# EAGLE design Э3 (EAGLE 9.6.2)
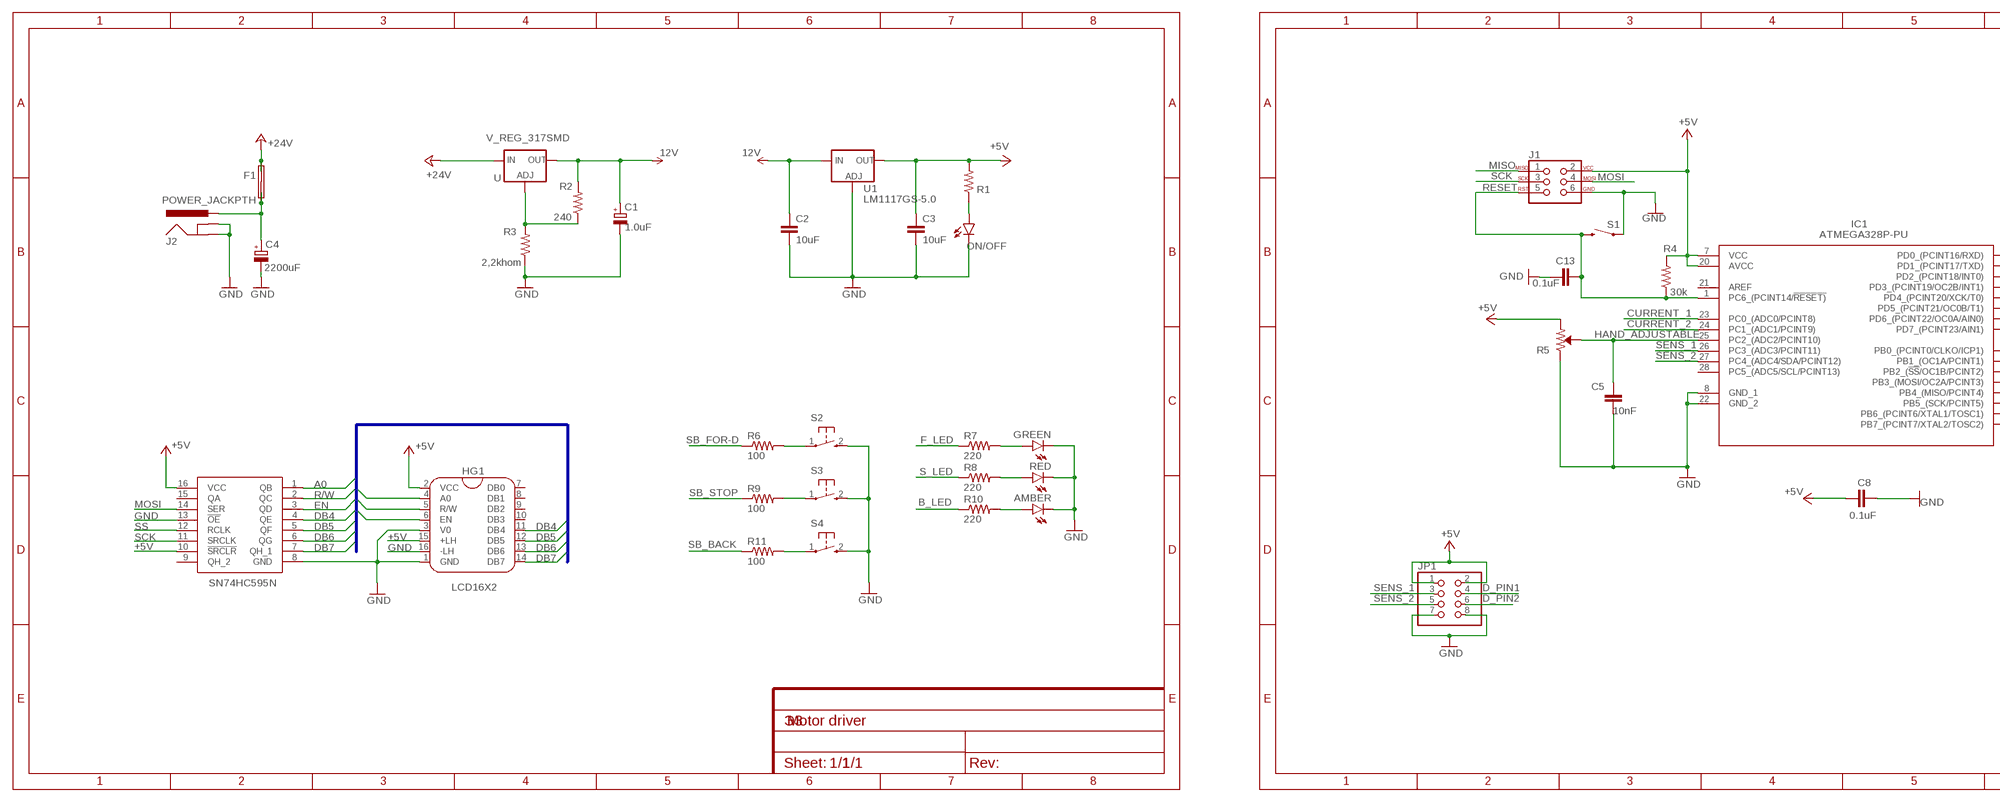
[diagram p0: schematic, sheet 1, part 1 of 2]
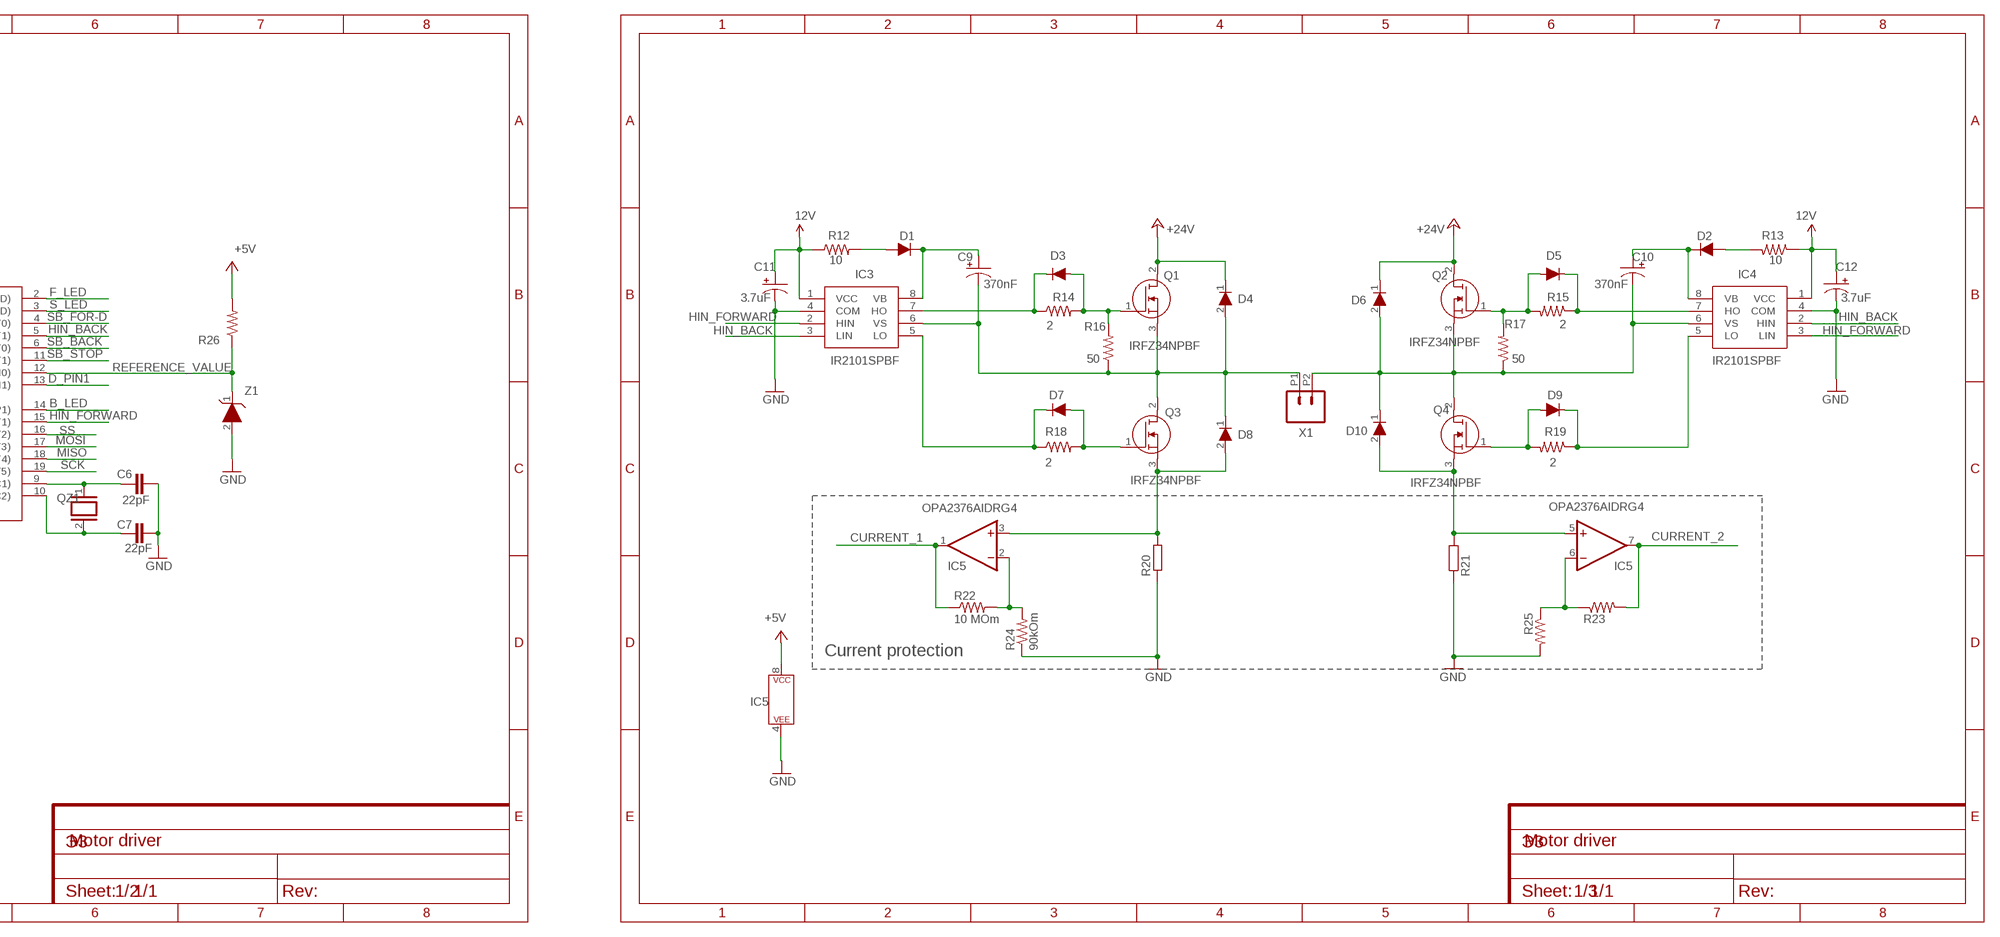
[diagram p1: schematic, sheet 1, part 2 of 2]

## Parts
AMBER  LED-3MM-NO_SILK  [LED3MM-NS]
C1  1.0uF  CPOL-EUE2,5-6E  [E2,5-6E]
C2  10uF  C-EUC1206  [C1206]
C3  10uF  C-EUC1206  [C1206]
C4  2200uF  CPOL-EUE5-10.5  [E5-10,5]
C5  10nF  C-EUC1206  [C1206]
C6  22pF  22PF-PTH-2.54MM-200V-5%  [CAP-PTH-2.54]
C7  22pF  22PF-PTH-2.54MM-200V-5%  [CAP-PTH-2.54]
C8  0.1uF  C-EUC1206  [C1206]
C9  370nF  CPOL-USSMCA  [SMC_A]
C10  370nF  CPOL-USSMCA  [SMC_A]
C11  3.7uF  CPOL-USSMCA  [SMC_A]
C12  3.7uF  CPOL-USSMCA  [SMC_A]
C13  0.1uF  C-EUC1206  [C1206]
D1  MURA110T3G  [DIOM5226X220N]
D2  MURA110T3G  [DIOM5226X220N]
D3  MBR0530T1G  [SOD3716X135N]
D4  1N4007E-E3_73  [DIOAD1405W86L465D235]
D5  MBR0530T1G  [SOD3716X135N]
D6  1N4007E-E3_73  [DIOAD1405W86L465D235]
D7  MBR0530T1G  [SOD3716X135N]
D8  1N4007E-E3_73  [DIOAD1405W86L465D235]
D9  MBR0530T1G  [SOD3716X135N]
D10  1N4007E-E3_73  [DIOAD1405W86L465D235]
F1  SHK20L  [SHK20L]
GREEN  LED-3MM-NO_SILK  [LED3MM-NS]
HG1  LCD16X2  [1X16]
IC1  ATMEGA328P-PU  [DIP794W53P254L3467H457Q28N]
IC2  SN74HC595N  [DIP794W53P254L1930H508Q16N]
IC3  IR2101SPBF  [SOIC127P600X175-8N]
IC4  IR2101SPBF  [SOIC127P600X175-8N]
IC5  OPA2376AIDRG4  [SOIC127P600X175-8N]
J1  AVR_SPI_PROG_3X2PTH  [2X3]
J2  POWER_JACKPTH  [POWER_JACK_PTH]
JP1  PINHD-2X4  [2X04]
ON/OFF  LED-3MM-NO_SILK  [LED3MM-NS]
Q1  IRFZ34NPBF  [TO254P469X1042X1967-3P]
Q2  IRFZ34NPBF  [TO254P469X1042X1967-3P]
Q3  IRFZ34NPBF  [TO254P469X1042X1967-3P]
Q4  IRFZ34NPBF  [TO254P469X1042X1967-3P]
QZ1  XTAL/S  [QS]
R1  200  R-US_R1206  [R1206]
R2  240  R-US_R1206  [R1206]
R3  2,2khom  R-US_R1206  [R1206]
R4  30k  R-US_R1206  [R1206]
R5  TRIMM_POT  [TRIMM_POT]
R6  100  R-US_R1206  [R1206]
R7  220  R-US_R1206  [R1206]
R8  220  R-US_R1206  [R1206]
R9  100  R-US_R1206  [R1206]
R10  220  R-US_R1206  [R1206]
R11  100  R-US_R1206  [R1206]
R12  10  R-US_R1206  [R1206]
R13  10  R-US_R1206  [R1206]
R14  2  R-US_0207/7  [0207/7]
R15  2  R-US_0207/7  [0207/7]
R16  50  R-US_0207/7  [0207/7]
R17  50  R-US_0207/7  [0207/7]
R18  2  R-US_0207/7  [0207/7]
R19  2  R-US_0207/7  [0207/7]
R20  R-EU_R2512  [R2512]
R21  R-EU_R2512  [R2512]
R22  10 MOm  R-US_R1206  [R1206]
R23  R-US_R1206  [R1206]
R24  90kOm  R-US_R1206  [R1206]
R25  R-US_R1206  [R1206]
R26  7  R-US_R1206  [R1206]
RED  LED-3MM-NO_SILK  [LED3MM-NS]
S1  MOMENTARY-SWITCH-SPST-PTH-6.0MM  [TACTILE_SWITCH_PTH_6.0MM]
S2  TAC_SWITCH_SPECIAL  [TACTILE-SPECIAL_PTH]
S3  TAC_SWITCH_SPECIAL  [TACTILE-SPECIAL_PTH]
S4  TAC_SWITCH_SPECIAL  [TACTILE-SPECIAL_PTH]
U  V_REG_317SMD  [SOT223]
U1  LM1117GS-5.0  V_REG_LM1117SOT223  [SOT223]
X1  DG340MY""  [1X02_3.81_SCREWTERM]
Z1  BZV55C3V6-TP"""  [BAQ33GS08]

## Nets
12V: C1.+ C2.1 C11.+ C12.+ IC3.1(VCC) IC4.1(VCC) R2.2 R12.1 R13.1 U1.3(IN) U.2(OUT)
+5V: C3.1 C8.1 HG1.2(VCC) HG1.15(+LH) IC1.7(VCC) IC1.20(AVCC) IC2.10(!SRCLR) IC2.16(VCC) IC5.8(P$V+) J1.2 JP1.1 JP1.2 R1.2 R4.2 R5.1(CCW) R26.2 U1.2(OUT) U1.4(OUT)
+24V: D4.1(K) D6.1(K) F1.2A F1.2B Q1.2(D) Q2.2(D) U.3(IN)
A0: HG1.4(A0) IC2.1(QB)
B_LED: IC1.14(PB0_(PCINT0/CLKO/ICP1)) R10.1
CURRENT_1: IC1.23(PC0_(ADC0/PCINT8)) IC5.1(OUT) R22.1
CURRENT_2: IC1.24(PC1_(ADC1/PCINT9)) IC5.7(OUT) R23.2
D_PIN1: IC1.13(PD7_(PCINT23/AIN1)) JP1.4
D_PIN2: JP1.6
DB4: HG1.11(DB4) IC2.4(QE)
DB5: HG1.12(DB5) IC2.5(QF)
DB6: HG1.13(DB6) IC2.6(QG)
DB7: HG1.14(DB7) IC2.7(QH_1)
EN: HG1.6(EN) IC2.3(QD)
F_LED: IC1.2(PD0_(PCINT16/RXD)) R7.1
GND: AMBER.K(C) C1.- C2.2 C3.2 C4.- C5.2 C6.2 C7.2 C8.2 C11.- C12.- C13.2 GREEN.K(C) HG1.1(GND) HG1.3(V0) HG1.16(-LH) IC1.8(GND_1) IC1.22(GND_2) IC2.8(GND) IC2.13(!OE) IC3.4(COM) IC4.4(COM) IC5.4(P$V-) J1.6 J2.GND J2.GNDBREAK JP1.7 JP1.8 ON/OFF.K(C) R3.1 R5.3(CW) R20.1 R21.1 R24.1 R25.2 RED.K(C) S1.1 S2.2 S3.2 S4.2 U1.1(ADJ) Z1.2(A)
HAND_ADJUSTABLE: C5.1 IC1.25(PC2_(ADC2/PCINT10)) R5.2(WIPER)
HIN_BACK: IC1.5(PD3_(PCINT19/OC2B/INT1)) IC3.3(LIN) IC4.2(HIN)
HIN_FORWARD: IC1.15(PB1_(OC1A/PCINT1)) IC3.2(HIN) IC4.3(LIN)
MISO: IC1.18(PB4_(MISO/PCINT4)) J1.1
MOSI: IC1.17(PB3_(MOSI/OC2A/PCINT3)) IC2.14(SER) J1.4
N$1: ON/OFF.A R1.1
N$2: C4.+ F1.1A F1.1B J2.PWR
N$3: D8.2(A) IC5.3(+IN) Q3.3(S) R20.2
N$4: D10.2(A) IC5.5(+IN) Q4.3(S) R21.2
N$5: GREEN.A R7.2
N$6: R8.2 RED.A
N$8: AMBER.A R10.2
N$9: R2.1 R3.2 U.1(ADJ)
N$10: R6.2 S2.1
N$11: R9.2 S3.1
N$12: R11.2 S4.1
N$13: C6.1 IC1.9(PB6_(PCINT6/XTAL1/TOSC1)) QZ1.1
N$14: C10.+ D2.1(K) IC4.8(VB)
N$15: C7.1 IC1.10(PB7_(PCINT7/XTAL2/TOSC2)) QZ1.2
N$17: C9.+ D1.1(K) IC3.8(VB)
N$18: IC5.2(-IN) R22.2 R24.2
N$19: C9.- D4.2(A) D8.1(K) IC3.6(VS) Q1.3(S) Q3.2(D) R16.1 X1.P1
N$20: IC5.6(-IN) R23.1 R25.1
N$21: D1.2(A) R12.2
N$22: D3.1(K) IC3.7(HO) R14.1
N$24: D3.2(A) Q1.1(G) R14.2 R16.2
N$25: D7.2(A) Q3.1(G) R18.2
N$26: D7.1(K) IC3.5(LO) R18.1
N$27: D2.2(A) R13.2
N$28: C10.- D6.2(A) D10.1(K) IC4.6(VS) Q2.3(S) Q4.2(D) R17.1 X1.P2
N$29: D5.1(K) IC4.7(HO) R15.1
N$32: D5.2(A) Q2.1(G) R15.2 R17.2
N$33: D9.2(A) Q4.1(G) R19.2
N$34: D9.1(K) IC4.5(LO) R19.1
R/W: HG1.5(R/W) IC2.2(QC)
REFERENCE_VALUE: IC1.12(PD6_(PCINT22/OC0A/AIN0)) R26.1 Z1.1(K)
RESET: C13.1 IC1.1(PC6_(PCINT14/!RESET)) J1.5 R4.1 S1.3
S_LED: IC1.3(PD1_(PCINT17/TXD)) R8.1
SB_BACK: IC1.6(PD4_(PCINT20/XCK/T0)) R11.1
SB_FOR-D: IC1.4(PD2_(PCINT18/INT0)) R6.1
SB_STOP: IC1.11(PD5_(PCINT21/OC0B/T1)) R9.1
SCK: IC1.19(PB5_(SCK/PCINT5)) IC2.11(SRCLK) J1.3
SENS_1: IC1.26(PC3_(ADC3/PCINT11)) JP1.3
SENS_2: IC1.27(PC4_(ADC4/SDA/PCINT12)) JP1.5
SS: IC1.16(PB2_(!SS!/OC1B/PCINT2)) IC2.12(RCLK)
Unconnected: HG1.7(DB0) HG1.8(DB1) HG1.9(DB2) HG1.10(DB3) IC1.21(AREF) IC1.28(PC5_(ADC5/SCL/PCINT13)) IC2.9(QH_2) IC2.15(QA)

## Buses
SHIFT:A0,DB[0..7],EN,R/W

## Notes on the sheet
- IC5 | IC5
- Current protection
- IC5
- Motor driver | Motor driver | Motor driver
- 1/1 | 1/2 | 1/3

## Library data of the parts
AMBER GREEN ON/OFF RED = SparkFun-LED:LED: LEDs Standard schematic elements and footprints for 5mm, 3mm, 1206, and 0603 sized LEDs. 5mm - Spark Fun Electronics SKU : COM-00529 (and others)
C1 C4 = rcl:CPOL-EU: POLARIZED CAPACITOR, European symbol; SPICEPREFIX: C
C2 C3 C5 C8 C13 = rcl:C-EU: CAPACITOR, European symbol; SPICEPREFIX: C
C6 C7 = SparkFun-Capacitors:22PF: 22pF ceramic capacitors A capacitor is a passive two-terminal electrical component used to store electrical energy temporarily in an electric field.; PROD_ID: CAP-09128
C9-C12 = rcl:CPOL-US: POLARIZED CAPACITOR, American symbol; SPICEPREFIX: C
D1 D2 = SamacSys_Parts:MURA110T3G: Source: Datasheet <http://www.onsemi.com/pub/Collateral/MURA105T3-D.PDF>; ARROW_PART_NUMBER: MURA110T3G; ARROW_PRICE-STOCK: https://www.arrow.com/en/products/mura110t3g/on-semiconductor; HEIGHT: 2.2mm; MANUFACTURER_NAME: ON Semiconductor; MANUFACTURER_PART_NUMBER: MURA110T3G; MOUSER_PART_NUMBER: 863-MURA110T3G; MOUSER_PRICE-STOCK: https://www.mouser.co.uk/ProductDetail/onsemi/MURA110T3G?qs=Gev%252BmEvV0iY9ayYiEBnOYw%3D%3D
D3 D5 D7 D9 = SamacSys_Parts:MBR0530T1G: Schottky Rectifier 0.5A 30V SOD-123 ON Semiconductor MBR0530T1G Schottky Diode, 0.5A, 30V, 2-Pin SOD-123 Source: Datasheet <http://www.onsemi.com/pub/Collateral/MBR0530T1-D.PDF>; ARROW_PART_NUMBER: MBR0530T1G; ARROW_PRICE-STOCK: https://www.arrow.com/en/products/mbr0530t1g/on-semiconductor?region=nac; DESCRIPTION: Schottky Rectifier 0.5A 30V SOD-123 ON Semiconductor MBR0530T1G Schottky Diode, 0.5A, 30V, 2-Pin SOD-123; HEIGHT: 1.35mm; MANUFACTURER_NAME: ON Semiconductor; MANUFACTURER_PART_NUMBER: MBR0530T1G; MOUSER_PART_NUMBER: 863-MBR0530T1G; MOUSER_PRICE-STOCK: https://www.mouser.co.uk/ProductDetail/onsemi/MBR0530T1G?qs=3JMERSakeboS%2FFOxJUMWeg%3D%3D
D4 D6 D8 D10 = SamacSys_Parts:1N4007E-E3_73: Rectifiers 1.0 Amp 1000 Volt Source: Datasheet <http://www.vishay.com/docs/88503/1n4001.pdf>; ARROW_PART_NUMBER: 1N4007E-E3/73; ARROW_PRICE-STOCK: https://www.arrow.com/en/products/1n4007e-e373/vishay; DESCRIPTION: Rectifiers 1.0 Amp 1000 Volt; HEIGHT: mm; MANUFACTURER_NAME: Vishay; MANUFACTURER_PART_NUMBER: 1N4007E-E3/73; MOUSER_PART_NUMBER: 625-1N4007E-E3/73; MOUSER_PRICE-STOCK: https://www.mouser.co.uk/ProductDetail/Vishay-General-Semiconductor/1N4007E-E3-73?qs=N4vtoAxH%2FSq0sSzLayHxEg%3D%3D
F1 = fuse:SHK20L: FUSE HOLDER 5 x 20 mm, SH contact, SHH1 Schukat, E1073 Buerklin; OC_FARNELL: unknown; OC_NEWARK: unknown
HG1 = My LCD16x2:LCD16X2: LCD 16X2 MT-16S2H2FLA
IC1 = SamacSys_Parts:ATMEGA328P-PU: MICROCHIP - ATMEGA328P-PU. - MICROCONTROLLER MCU, 8 BIT, ATMEGA, 20MHZ, DIP-28 Source: Datasheet <https://datasheet.datasheetarchive.com/originals/distributors/Datasheets_SAMA/59a954cf62ab8fb92f29cdfb51cb433a.pdf>; ARROW_PART_NUMBER: ATMEGA328P-PU; ARROW_PRICE-STOCK: https://www.arrow.com/en/products/atmega328p-pu/microchip-technology?region=nac; DESCRIPTION: MICROCHIP - ATMEGA328P-PU. - MICROCONTROLLER MCU, 8 BIT, ATMEGA, 20MHZ, DIP-28; HEIGHT: 4.572mm; MANUFACTURER_NAME: Microchip; MANUFACTURER_PART_NUMBER: ATMEGA328P-PU; MOUSER_PART_NUMBER: 556-ATMEGA328P-PU; MOUSER_PRICE-STOCK: https://www.mouser.co.uk/ProductDetail/Microchip-Technology-Atmel/ATMEGA328P-PU?qs=K8BHR703ZXguOQv3sKbWcg%3D%3D
IC2 = SamacSys_Parts:SN74HC595N: 8-Bit Shift Registers With 3-State Output Registers Source: Datasheet <http://www.ti.com/lit/ds/symlink/sn74hc595.pdf>; ARROW_PART_NUMBER: SN74HC595N; ARROW_PRICE-STOCK: https://www.arrow.com/en/products/sn74hc595n/texas-instruments; DESCRIPTION: 8-Bit Shift Registers With 3-State Output Registers; HEIGHT: 5.08mm; MANUFACTURER_NAME: Texas Instruments; MANUFACTURER_PART_NUMBER: SN74HC595N; MOUSER_PART_NUMBER: 595-SN74HC595N; MOUSER_PRICE-STOCK: https://www.mouser.co.uk/ProductDetail/Texas-Instruments/SN74HC595N/?qs=IEl3ej0IqwBTHkYa8XPoMQ%3D%3D
IC3 IC4 = SamacSys_Parts:IR2101SPBF: Gate Drivers HI LO SIDE DRVR 600V 130mA 50ns Source: Datasheet <https://www.infineon.com/dgdl/ir2101.pdf?fileId=5546d462533600a4015355c7a755166c>; ARROW_PART_NUMBER: IR2101SPBF; ARROW_PRICE-STOCK: https://www.arrow.com/en/products/ir2101spbf/infineon-technologies-ag?region=nac; DESCRIPTION: Gate Drivers HI LO SIDE DRVR 600V 130mA 50ns; HEIGHT: 1.75mm; MANUFACTURER_NAME: Infineon; MANUFACTURER_PART_NUMBER: IR2101SPBF; MOUSER_PART_NUMBER: 942-IR2101SPBF; MOUSER_PRICE-STOCK: https://www.mouser.co.uk/ProductDetail/Infineon-IR/IR2101SPBF?qs=dQmlx5f5cRK0Gls2VgsKEQ%3D%3D
IC5 = SamacSys_Parts:OPA2376AIDRG4: Precision Amplifiers Prec Lo Noise Lo Quies Current Op Amp Source: Datasheet <https://datasheet.datasheetarchive.com/originals/distributors/SFDatasheet-6/sf-000133686.pdf>; ARROW_PART_NUMBER: OPA2376AIDRG4; ARROW_PRICE-STOCK: https://www.arrow.com/en/products/opa2376aidrg4/texas-instruments; DESCRIPTION: Precision Amplifiers Prec Lo Noise Lo Quies Current Op Amp; HEIGHT: 1.75mm; MANUFACTURER_NAME: Texas Instruments; MANUFACTURER_PART_NUMBER: OPA2376AIDRG4; MOUSER_PART_NUMBER: 595-OPA2376AIDRG4; MOUSER_PRICE-STOCK: https://www.mouser.co.uk/ProductDetail/Texas-Instruments/OPA2376AIDRG4?qs=IUbkBnfnSQIcJ9njy8NzUg%3D%3D
J1 = SparkFun-Connectors:AVR_SPI_PROG_3X2: AVR ISP 6 Pin This is the reduced ISP connector for AVR programming. Common on Arduino. This footprint will take up less PCB space and can be used with a 10-pin to 6-pin adapter such as SKU: BOB-08508 **Special note about "TEST_POINT" package. The stop mask is on the top side, so if you want your programming test points to be on the bottom of your board, make sure to place this package on the bottom side of the board. This also ensure that the orientation to program from the bottom side will be correct. SparkFun Products: SparkFun ISP Pogo Adapter <https://www.sparkfun.com/products/11591> - NS Tiny AVR Programmer <https://www.sparkfun.com/products/11801> -PTH
J2 = SparkFun-Connectors:POWER_JACK: Power Jack This is the standard 5.5mm barrel jack for power. The PTH is the most common, proven, reliable, footprint. The Slot footprint only works if the mill layer is transmitted to the PCB fab house so be warned. Mating wall wart : TOL-00298 (and others); PROD_ID: CONN-08197
JP1 = pinhead:PINHD-2X4: PIN HEADER
Q1-Q4 = IRFZ34NPBF:IRFZ34NPBF: N-channel MOSFET,IRFZ34N 26A 55V Source: Datasheet <https://datasheet.datasheetarchive.com/originals/distributors/Datasheets_SAMA/6217abc42b771e712c1bb559b7791c65.pdf>; ARROW_PART_NUMBER: IRFZ34NPBF; ARROW_PRICE-STOCK: https://www.arrow.com/en/products/irfz34npbf/infineon-technologies-ag?region=nac; DESCRIPTION: N-channel MOSFET,IRFZ34N 26A 55V; HEIGHT: 4.69mm; MANUFACTURER_NAME: Infineon; MANUFACTURER_PART_NUMBER: IRFZ34NPBF; MOUSER_PART_NUMBER: 942-IRFZ34NPBF; MOUSER_PRICE-STOCK: https://www.mouser.co.uk/ProductDetail/Infineon-IR/IRFZ34NPBF?qs=9%252BKlkBgLFf3Kc9ZWbyua6Q%3D%3D
QZ1 = special:XTAL/S: CRYSTAL
R1-R4 R6-R19 R22-R26 = rcl:R-US_: RESISTOR, American symbol; SPICEPREFIX: R
R5 = potentiometers:TRIMM_POT
R20 R21 = rcl:R-EU_: RESISTOR, European symbol; SPICEPREFIX: R
S1 = SparkFun-Switches:MOMENTARY-SWITCH-SPST: Momentary Switch (Pushbutton) - SPST Normally-open (NO) SPST momentary switches (buttons, pushbuttons). Variants PTH-12MM - 12mm square, through-hole Momentary Pushbutton Switch - 12mm Square <https://www.sparkfun.com/products/9190> (COM-09190) PTH-6.0MM, PTH-6.0MM-KIT - 6.0mm square, through-hole Mini Pushbutton Switch <https://www.sparkfun.com/products/97> (COM-00097) KIT package intended for soldering kit's - only one side of pads' copper is exposed. PTH-RIGHT-ANGLE-KIT - Right-angle, through-hole Right Angle Tactile Button <https://www.sparkfun.com/products/10791> - Used on SparkFun BigTime Watch Kit <https://www.sparkfun.com/products/11734> SMD-12MM - 12mm square, surface-mount Tactile Button - SMD (12mm) <https://www.sparkfun.com/products/12993> (COM-12993) Used on SparkFun PicoBoard <https://www.sparkfun.com/products/11888> SMD-4.5MM - 4.5mm Square Trackball Switch Used on SparkFun Blackberry Trackballer Breakout <https://www.sparkfun.com/products/13169> SMD-4.6MMX2.8MM - 4.60mm x 2.80mm, surface mount Used on SparkFun Pro Micro - RP2040 <https://www.sparkfun.com/products/17717> SMD-5.2MM, SMD-5.2-REDUNDANT - 5.2mm square, surface-mount Mini Pushbutton Switch - SMD <https://www.sparkfun.com/products/8720> (COM-08720) Used on Arduino Pro Mini <https://www.sparkfun.com/products/11114> REDUNDANT package connects both switch circuits together SMD-6.0X3.5MM - 6.0 x 3.5mm, surface mount Momentary Reset Switch SMD <https://www.sparkfun.com/products/8229> (COM-08229) SMD-6.2MM-TALL - 6.2mm square, surface mount Tactile Button - SMD (6mm) <https://www.sparkfun.com/products/12992> Used on SparkFun Digital Sandbox <https://www.sparkfun.com/products/12651> SMD-RIGHT-ANGLE - Right-angle, surface mount Used on SparkFun Block for Intel® Edison - Arduino <https://www.sparkfun.com/products/13036>; PROD_ID: SWCH-08441; SF_SKU: COM-00097
S2-S4 = SparkFun-Retired:TAC_SWITCH_SPECIAL: Tac Switch Button commonly used for reset or general input. Spark Fun Electronics SKU : COM-00097 SMT- SWCH-08247
U = SparkFun-PowerIC:V_REG_317: Voltage Regulator Standard LM317 adjustable voltage regulator. AOI (Adjust Output Input). Google 'LM317 Calculator' for easy to use app to get the two resistor values needed. 240/720 for 5V output. 240/390 for 3.3V output. Spark Fun Electronics SKU : COM-00527
U1 = SparkFun-IC-Power:V_REG_LM1117: Voltage Regulator LM1117 Standard adjustable voltage regulator but in SMD form. Spark Fun Electronics SKU : COM-00595; PROD_ID: VREG-08170
X1 = DG340MY:DG340MY: DG340 Функциональное назначение: клеммник винтовой. Шаг контактов: 3.81. Рабочий ток: 7А.
Z1 = SamacSys_Parts:BZV55C3V6-TP: Zener Diodes 3.6V 600Ohms Source: Datasheet <http://www.mccsemi.com/up_pdf/BZV55C Series(MiniMELF).pdf>

## Module ARDUINO_MICRO
Ports: 

### Library data of the parts

## Module DSS
Ports: 

### Library data of the parts

## Board
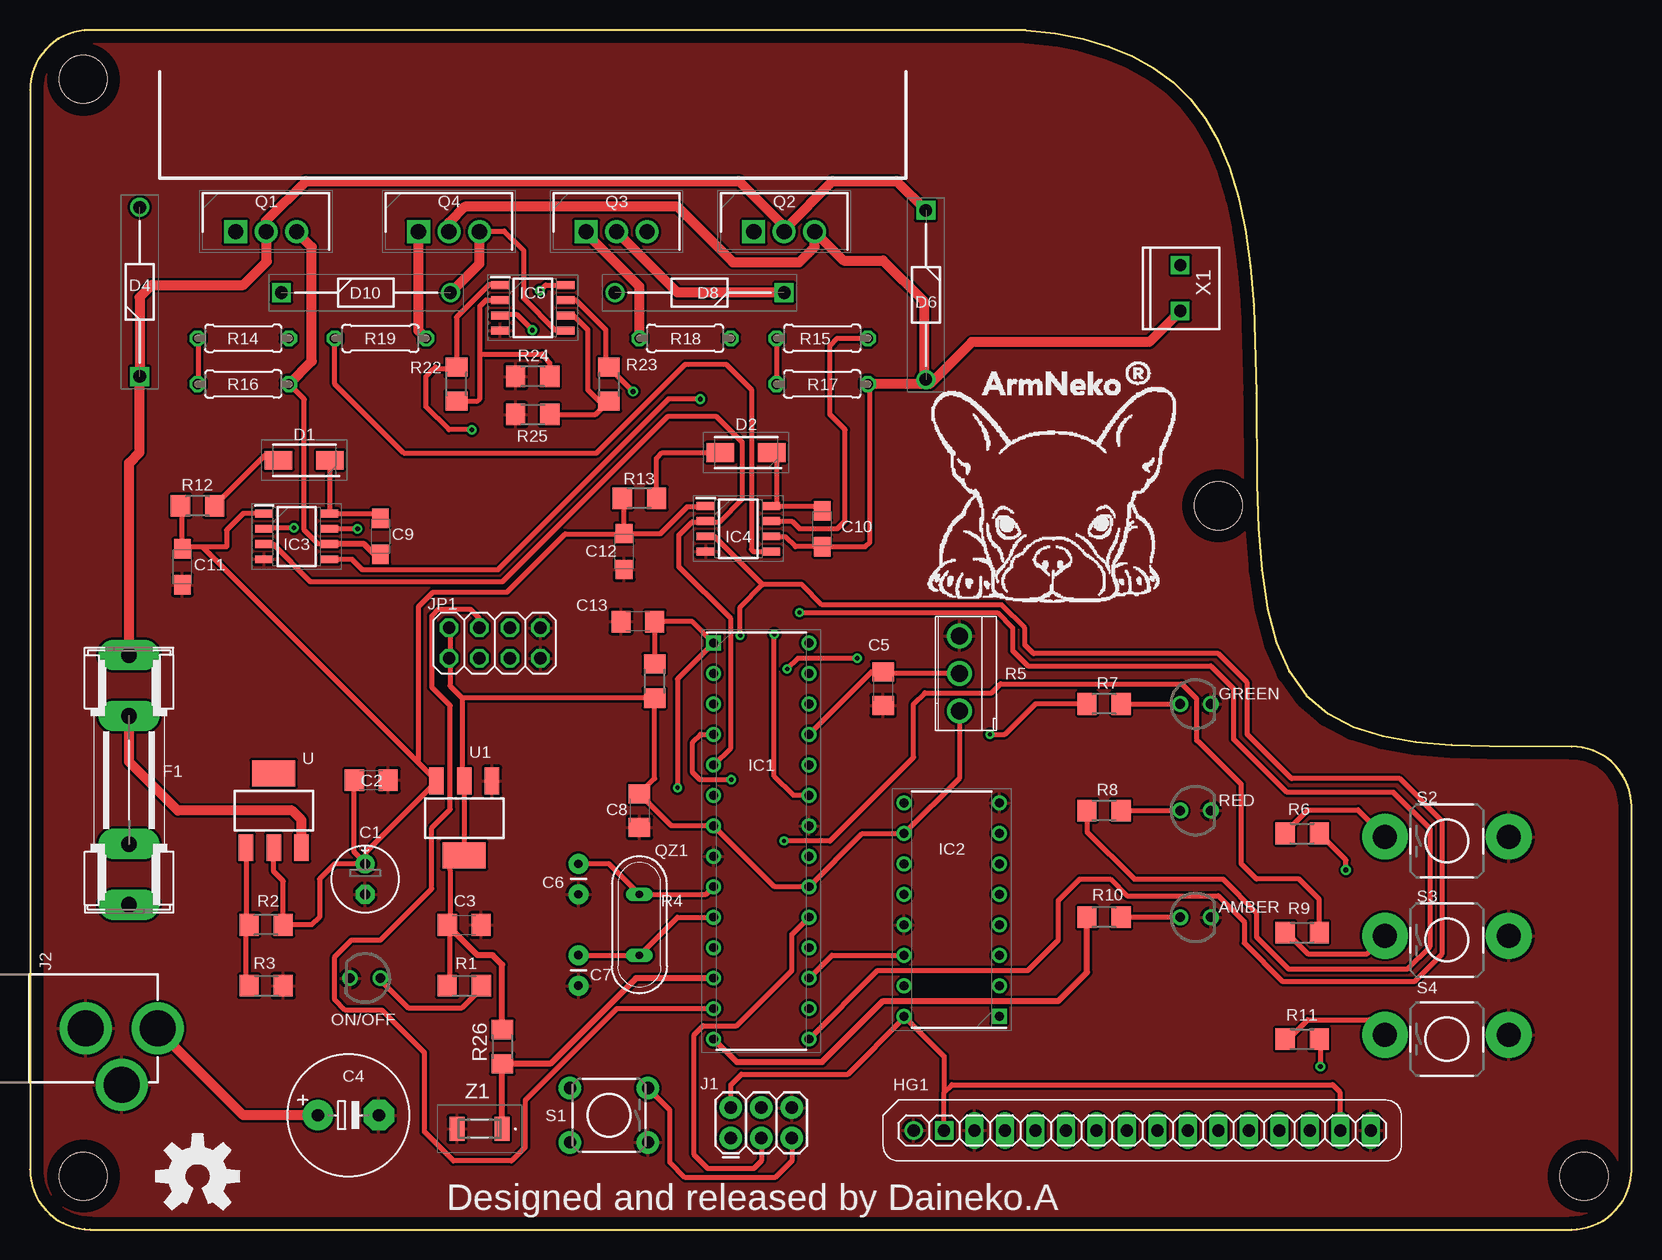
[diagram p2: board, top side]
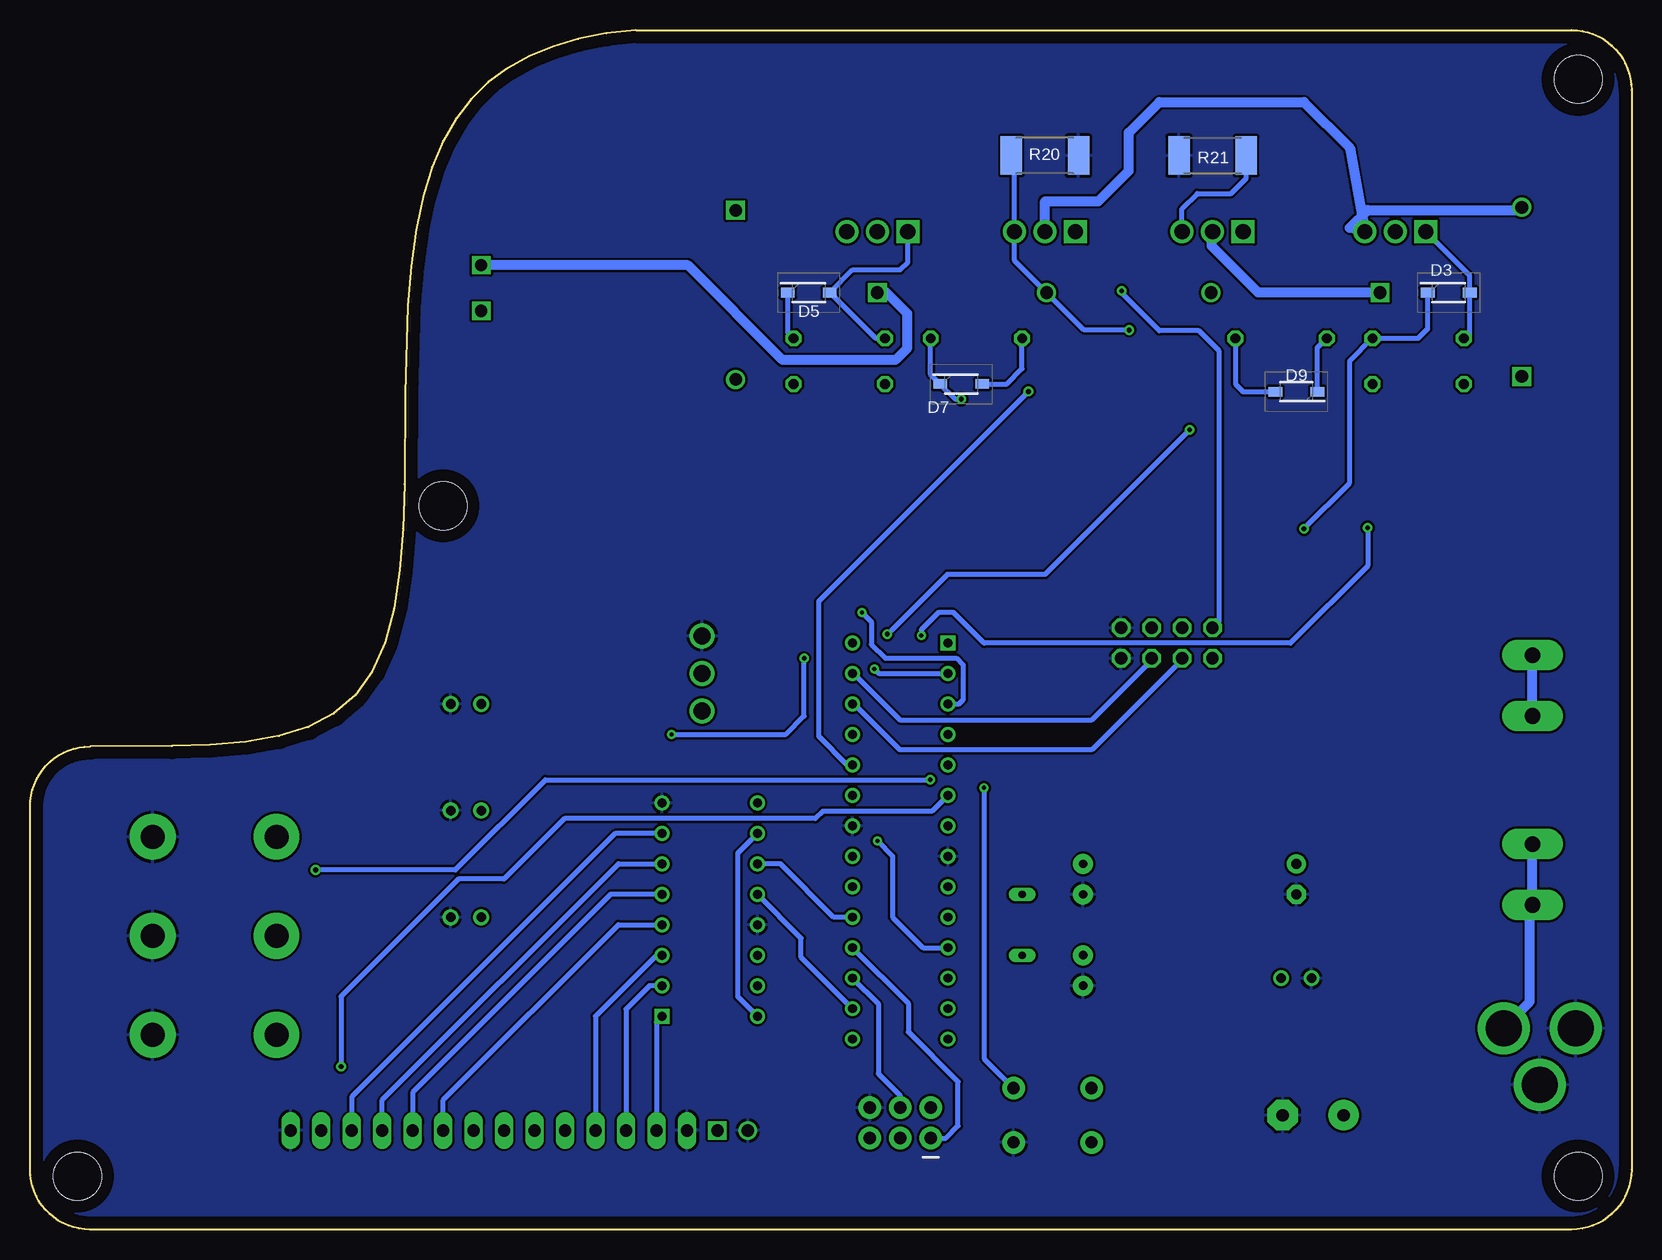
[diagram p3: board, bottom side, seen from below]

Size 133.5 x 100 mm. Coordinates in mm from the lower left corner, seen from the top.
Outline: 83,100 5,100 arc90 0,95 0,5 arc90 5,0 128.5,0 arc90 133.5,5 133.5,35.27 arc90 128.49,40.27 121.67,40.3 118.49,40.41 115.5,40.66 112.76,41.13 110.31,41.89 108.18,43.01 106.4,44.54 104.98,46.51 103.91,48.94 103.16,51.77 102.68,54.97 102.41,58.45 102.29,62.13 102.23,69.72 102,76.99 101.72,80.31 101.3,83.37 100.73,86.12 99.99,88.57 99.08,90.73 98,92.61 96.73,94.24 95.29,95.64 93.68,96.82 91.89,97.81 89.92,98.62 87.78,99.25 85.48,99.71 83,100
Copper layers (1*16): Top 0.035mm / dielectric 1.5mm / Bottom 0.035mm
Design rules "default *": minimum track width 8mil, minimum drill 0.35mm, track to track 8mil, track to pad 8mil, pad to pad 8mil, via to via 8mil, smd to smd 8mil, copper to edge 40mil, drill to drill 6mil, minimum pad ring 10mil, minimum via ring 8mil, stop-mask expansion 4mil, vias tented up to drill 0mil, thermal gap 10mil
Holes 4 mm at 4.45,95.89 99.06,60.33 129.54,4.45 4.45,4.45

### Footprints (pad centres in the part's own frame; a part is rotated, then mirrored left to right if it is on the bottom)
LED3MM-NS = drill 0.813: A -1.27,0; K 1.27,0
E2,5-6E = drill 0.813 pad 1.575: + -1.27,0 | drill 0.813 pad 1.575 octagon: - 1.27,0
C1206 = smd 1.6 x 1.8: 1 -1.4,0; 2 1.4,0
E5-10,5 = drill 1.016 pad 2.54: + -2.54,0 | drill 1.016 pad 2.54 octagon: - 2.54,0
CAP-PTH-2.54 = drill 0.7 pad 1.651: 1 -1.27,0; 2 1.27,0
SMC_A = smd 1.6 x 1.4: + -1.5,0; - 1.5,0
DIOM5226X220N = smd 2.3 x 1.55: 1 -2.15,0; 2 2.15,0
SOD3716X135N = smd 1.15 x 0.8: 1 -1.75,0; 2 1.75,0
DIOAD1405W86L465D235 = drill 1.05 pad 1.575 square: 1 0,0 | drill 1.05 pad 1.575: 2 14.1,0
SHK20L = drill 1.321 pad 2.54 long: 1A -10.414,0; 1B -5.334,0; 2A 10.414,0; 2B 5.334,0
1X16 = drill 1.016: 1 2.54,-2.54 | drill 1.016 square: 2 5.08,-2.54 | drill 1.016 long: 3 7.62,-2.54; 4 10.16,-2.54; 5 12.7,-2.54; 6 15.24,-2.54; 7 17.78,-2.54; 8 20.32,-2.54; 9 22.86,-2.54; 10 25.4,-2.54; 11 27.94,-2.54; 12 30.48,-2.54; 13 33.02,-2.54; 14 35.56,-2.54; 15 38.1,-2.54; 16 40.64,-2.54
DIP794W53P254L3467H457Q28N = drill 0.733 pad 1.133 square: 1 -3.969,16.51 | drill 0.733 pad 1.133: 2 -3.969,13.97; 3 -3.969,11.43; 4 -3.969,8.89; 5 -3.969,6.35; 6 -3.969,3.81; 7 -3.969,1.27; 8 -3.969,-1.27; 9 -3.969,-3.81; 10 -3.969,-6.35; 11 -3.969,-8.89; 12 -3.969,-11.43; 13 -3.969,-13.97; 14 -3.969,-16.51; 15 3.969,-16.51; 16 3.969,-13.97; 17 3.969,-11.43; 18 3.969,-8.89; 19 3.969,-6.35; 20 3.969,-3.81; 21 3.969,-1.27; 22 3.969,1.27; 23 3.969,3.81; 24 3.969,6.35; 25 3.969,8.89; 26 3.969,11.43; 27 3.969,13.97; 28 3.969,16.51
DIP794W53P254L1930H508Q16N = drill 0.73 pad 1.13 square: 1 -3.97,8.89 | drill 0.73 pad 1.13: 2 -3.97,6.35; 3 -3.97,3.81; 4 -3.97,1.27; 5 -3.97,-1.27; 6 -3.97,-3.81; 7 -3.97,-6.35; 8 -3.97,-8.89; 9 3.97,-8.89; 10 3.97,-6.35; 11 3.97,-3.81; 12 3.97,-1.27; 13 3.97,1.27; 14 3.97,3.81; 15 3.97,6.35; 16 3.97,8.89
SOIC127P600X175-8N = smd 1.528 x 0.65: 1 -2.711,1.905; 2 -2.711,0.635; 3 -2.711,-0.635; 4 -2.711,-1.905; 5 2.711,-1.905; 6 2.711,-0.635; 7 2.711,0.635; 8 2.711,1.905
2X3 = drill 1.016 pad 1.88: 1 0,0; 2 0,2.54; 3 2.54,0; 4 2.54,2.54; 5 5.08,0; 6 5.08,2.54
POWER_JACK_PTH = drill 2.997 pad 4.318: GND 0,7.7; GNDBREAK 4.7,10.7; PWR 0,13.7
2X04 = drill 1.016 octagon: 1 -3.81,-1.27; 2 -3.81,1.27; 3 -1.27,-1.27; 4 -1.27,1.27; 5 1.27,-1.27; 6 1.27,1.27; 7 3.81,-1.27; 8 3.81,1.27
TO254P469X1042X1967-3P = drill 1.28 pad 1.92 square: 1 0,0 | drill 1.28 pad 1.92: 2 2.54,0; 3 5.08,0
QS = drill 0.61 long: 1 -2.54,0; 2 2.54,0
R1206 = smd 1.6 x 1.803: 1 -1.422,0; 2 1.422,0
TRIMM_POT = drill 1.4: 1 -3.135,2.54; 2 0,2.54; 3 3.135,2.54
0207/7 = drill 0.813 octagon: 1 -3.81,0; 2 3.81,0
R2512 = smd 1.8 x 3.2: 1 -2.8,0; 2 2.8,0
TACTILE_SWITCH_PTH_6.0MM = drill 1.016 pad 1.88: 1 -3.251,2.261; 2 3.251,2.261; 3 -3.251,-2.261; 4 3.251,-2.261
TACTILE-SPECIAL_PTH = drill 2 pad 3.81: 1 -5.156,0.356; 2 5.156,0.356
SOT223 = smd 1.219 x 2.235: 1 -2.311,-3.099; 2 0,-3.099; 3 2.311,-3.099 | smd 3.6 x 2.2: 4 0,3.099
1X02_3.81_SCREWTERM = drill 1.016 square: P1 3.175,0; P2 -0.635,0
BAQ33GS08 = smd 1.25 x 2: 1 -1.875,0; 2 1.875,0

### Placement (x,y rotation side)
AMBER  97.16,26.04 0 top
C1  27.94,29.21 270 top
C2  28.45,37.47 0 top
C3  36.2,25.4 0 top
C4  26.54,9.53 0 top
C5  71.12,45.09 270 top
C6  45.72,29.21 270 top
C7  45.72,21.59 270 top
C8  50.8,34.92 270 top
C9  29.21,57.78 270 top
C10  66.04,58.42 270 top
C11  12.7,55.24 270 top
C12  49.53,56.52 270 top
C13  50.67,50.67 180 top
D1  22.86,64.14 180 top
D2  59.69,64.77 180 top
D3  15.24,78.11 0 bottom
D4  9.14,71.12 90 top
D5  68.58,78.11 0 bottom
D6  74.68,84.96 270 top
D7  55.88,70.48 0 bottom
D8  62.87,78.11 180 top
D9  27.94,69.85 180 bottom
D10  20.95,78.11 0 top
F1  8.26,37.47 90 top
GREEN  97.16,43.81 0 top
HG1  71.12,10.79 0 top
IC1  60.96,32.38 0 top
IC2  76.83,26.67 180 top
IC3  22.23,57.78 0 top
IC4  59.05,58.42 0 top
IC5  41.91,76.83 0 top
J1  58.42,7.62 0 top
J2  -3.05,16.76 270 top
JP1  38.73,48.9 0 top
ON/OFF  27.94,20.95 180 top
Q1  17.14,83.19 0 top
Q2  60.33,83.19 0 top
Q3  46.35,83.19 0 top
Q4  32.38,83.19 0 top
QZ1  50.8,25.4 270 top
R1  36.2,20.32 180 top
R2  19.68,25.4 0 top
R3  19.68,20.32 180 top
R4  52.07,45.72 270 top
R5  80.01,46.35 90 top
R6  106.05,33.02 180 top
R7  89.53,43.81 0 top
R8  89.53,34.92 0 top
R9  106.05,24.77 180 top
R10  89.53,26.04 0 top
R11  106.05,15.88 180 top
R12  13.97,60.33 0 top
R13  50.8,60.96 0 top
R14  17.78,74.3 180 top
R15  66.04,74.3 180 top
R16  17.78,70.48 180 top
R17  66.04,70.48 180 top
R18  54.61,74.3 180 top
R19  29.21,74.3 0 top
R20  48.9,89.53 180 bottom
R21  34.92,89.53 0 bottom
R22  35.56,70.48 270 top
R23  48.26,70.48 90 top
R24  41.91,71.12 0 top
R25  41.91,67.94 180 top
R26  39.37,15.24 90 top
RED  97.16,34.92 0 top
S1  48.26,9.53 180 top
S2  118.11,32.38 0 top
S3  118.11,24.13 0 top
S4  118.11,15.88 0 top
U  20.32,34.92 0 top
U1  36.2,34.29 180 top
U$1  [OSHW-LOGO-L]  13.97,4.45 0 top
X1  95.89,77.22 90 top
Z1  37.47,8.38 180 top

### Tracks (layer width: path | path; a pad name or v marks a point on that pad's centre or on a via)
12V
  Top 0.203: 12.88,56.9 C11.+ | 12.65,60.25 R12.1 | 28,30.5 C1.+ | 49.5,58 C12.+
  Top 0.406: IC4.1 56.27,60.25 54.76,60.25 52.51,57.99 49.55,57.99 C12.+ 49.5,58.5 49.5,60.5 R13.1 | C2.1 27,37 27,31.5 28,30.5 28,31.5 33.5,37 U1.3 | 49.5,58 44.62,58 39.76,53.14 33.6,53.14 32.38,51.92 32.38,38.89 U1.3 | C11.+ 12.7,60.2 12.65,60.25 | U1.3 14.38,56.9 | 14.38,56.9 12.88,56.9 | IC3.1 17.78,59.69 16.38,58.29 16.38,56.9 14.38,56.9 | C1.+ 25.4,30.48 24.13,29.21 24.13,26.04 23.5,25.4 R2.2 21.11,29.06 20.32,29.84 U.2
+5V  (via drill 0.4)
  Top 0.203: 35,25 34.82,25.35 C3.1 35,25.5 | 35,20.5 R1.2 | 36.25,37.32 U1.2 36,37.5 | 36.25,31.24 U1.4 36,31 35,30
  Top 0.406: 35,20.5 35,25 | 36.25,31.24 36.25,37.32 | 35,30 35,25.5 | 35,48 35,50 JP1.2 | 35,48 35,45.32 36,44.32 | 36,44.32 36,37.5 | 35,48 JP1.1 | v42.49,78.25 42.99,78.74 IC5.8 | R5.1 77.47,37.62 IC2.10 69.37,33.02 IC1.20 62.07,28.57 IC1.7 53.47,33.66 C8.1 52.07,37.59 R4.2 36.02,44.3 36,44.32 | J1.2 58.42,12.06 59.31,12.95 68.18,12.95 72.86,17.64 IC2.16 76.2,14.45 76.2,11.43 | HG1.2 76.2,11.43 | 76.2,11.43 76.83,12.06 108.58,12.06 109.22,11.43 HG1.15
  Top 0.508: R26.2 39.37,22.07 38.58,22.86 37.31,22.86 34.82,25.35
  Bottom 0.406: JP1.2 34.37,50.73 34.37,73.23 36.07,74.93 39.37,74.93 42.49,78.05 v42.49,78.25 | IC2.10 74.5,31.39 74.5,19.41 IC2.16
+24V
  Top 0.813: D6.1 72.23,87.41 66.91,87.41 63,83.5 Q2.2 62.87,83.64 59.09,87.41 23.01,87.41 19.68,84.09 Q1.2 19.73,83.18 19.73,80.69 17.78,78.74 10.16,78.74 9.14,77.72 D4.1 9.14,64.79 8.26,63.91 F1.2A | U.3 22.63,34.14 21.84,34.92 12.32,34.92 8.26,38.99 F1.2B
  Bottom 0.813: F1.2B F1.2A
A0
  Bottom 0.406: IC2.1 81.28,17.3 HG1.4
B_LED
  Top 0.508: IC1.14 58.9,13.97 66.04,13.97 71.12,19.05 85.72,19.05 88.11,21.44 R10.1
CURRENT_1  (via drill 0.4)
  Top 0.406: IC5.1 39.19,78.75 38.25,78.75 35.56,76.06 R22.1 35.41,71.75 33.66,71.75 | IC1.23 63.63,36.2 62.04,37.78 v62.04,49.63 | v36.83,66.67 34.92,66.67 33.02,68.58 33.02,71.12 33.66,71.75 | 33.81,71.91 33.66,71.75
  Bottom 0.406: v36.83,66.67 48.9,54.61 57.02,54.61 62,49.63 v62.04,49.63
CURRENT_2  (via drill 0.4)
  Top 0.203: 48,72 R23.2
  Top 0.406: IC5.7 44.59,77.5 45.5,77.5 48,75 48,72 | R23.2 48.37,71.8 48.37,71.77 v50.27,69.86
  Bottom 0.406: IC1.24 65.38,38.73 67.77,41.13 67.77,52.37 v50.27,69.86
D_PIN1
  Top 0.406: IC1.13 48.91,18.41 41.27,10.78 41.27,6.86 40.13,5.71 35.31,5.71 32.89,8.13 32.89,14.73 29.34,18.29 26.29,18.29 25.4,19.18 25.4,22.73 26.8,24.13 29.21,24.13 33.48,28.4 33.48,33.48 35.03,35.02 35.03,43.67 33.5,45.2 33.5,51.16 34.06,51.71 36.68,51.71 37.47,50.93 JP1.4
DB4
  Bottom 0.406: HG1.11 99.06,10.79 84.45,25.4 IC2.4
DB5
  Bottom 0.406: IC2.5 85.09,27.94 101.6,11.43 HG1.12
DB6
  Bottom 0.406: HG1.13 104.14,10.79 84.45,30.48 IC2.6
DB7
  Bottom 0.406: IC2.7 84.71,33.02 106.68,11.05 HG1.14
EN
  Bottom 0.406: IC2.3 81.28,22.86 86.36,17.78 HG1.6
F_LED  (via drill 0.35)
  Top 0.406: R7.1 83.82,43.81 81.28,41.27 v80.01,41.27 | v68.96,47.62 64.01,47.62 v63.12,46.74
  Bottom 0.406: v80.01,41.27 70.48,41.27 68.96,42.8 v68.96,47.62 | v63.12,46.74 62.74,46.35 IC1.2
GND
  pour Bottom: 133.1,-0.25 1.52,-0.25 0,1.27 0,97.79 2.54,100.33 91.44,100.33 104.14,87.63 104.14,49.53 111.76,41.91 130.81,41.91 133.99,38.73 133.99,0.64
  pour Top: 133.1,-0.25 1.52,-0.25 0,1.27 0,97.79 2.54,100.33 91.44,100.33 104.14,87.63 104.14,49.53 111.76,41.91 130.81,41.91 133.99,38.73 133.99,0.64
HAND_ADJUSTABLE
  Top 0.406: IC1.25 70.14,46.48 C5.1 71.25,46.35 R5.2
HIN_BACK
  Top 0.203: 19.59,57.13 IC3.3
  Top 0.406: 19.59,57.13 20.25,57.13 23.39,53.99 39.36,53.99 53.13,67.77 57.23,67.77 59.38,65.62 59.38,60.88 57.5,59 56.5,59 | 56.5,59 IC4.2 | IC1.5 58.42,40.16 58.42,50.93 54.1,55.24 54.1,57.91 55.19,59 56.5,59
HIN_FORWARD  (via drill 0.35, 0.4)
  Top 0.406: v22,58.5 20,58.5 IC3.2 | IC1.15 70.64,21.59 83.19,21.59 85.72,24.13 85.72,27.43 87.5,29.21 90.04,29.21 91.44,27.81 99.06,27.81 101.22,25.65 101.22,23.88 104.39,20.7 115.44,20.7 117.73,22.99 117.73,34.04 114.17,37.59 105.16,37.59 101.47,41.27 101.47,45.59 99.06,48.01 83.67,48.01 82.93,48.74 82.93,50.14 81,52.07 66.04,52.07 64.36,53.75 61.08,53.75 | IC4.3 57.05,57.78 61.08,53.75 | v59.2,49.53 59.2,51.87 61.08,53.75
  Bottom 0.406: v22,58.5 22,55.33 28.43,48.9 53.98,48.9 56.52,51.44 57.78,51.44 59.2,50.02 v59.2,49.53
MISO
  Bottom 0.406: J1.1 57.15,7.62 56.13,8.64 56.13,12.32 60.28,16.46 60.28,18.84 IC1.18
MOSI
  Top 0.406: IC1.17 66.83,22.86 IC2.14
  Bottom 0.406: J1.4 60.96,11.18 62.78,13 62.78,18.81 IC1.17
N$1
  Top 0.406: R1.1 37.5,20 36,18.5 31.5,18.5 29.5,20.5 ON/OFF.A
N$2
  Top 0.813: C4.+ 17.78,9.53 10.65,16.65 J2.PWR
  Bottom 0.203: 10.5,17 J2.PWR
  Bottom 0.813: 10.5,17 8.5,19 8.5,27 F1.1A F1.1B
N$3  (via drill 0.4)
  Top 0.406: v41.88,74.98 40.61,76.25 39.25,76.25 IC5.3
  Bottom 0.406: v41.88,74.98 45.64,74.98 D8.2 51.44,80.78 Q3.3 51.44,89.28 R20.2
N$4
  Top 0.406: IC5.5 44.5,75 43.75,75 41.13,77.63 41.13,81.65 39.53,83.25 37.53,83.25 Q4.3
  Top 0.813: D10.2 37.47,80.52 Q4.3
  Bottom 0.406: Q4.3 37.47,85.09 36.2,86.36 33.4,86.36 32.12,87.63 R21.2
N$5
  Top 0.406: R7.2 GREEN.A
N$6
  Top 0.406: R8.2 RED.A
N$8
  Top 0.406: AMBER.A R10.2
N$9
  Top 0.203: 18,25.5 R2.1
  Top 0.406: R2.1 18.01,25.65 U.1 | R3.2 18,20.58 18,25.5
N$10
  Top 0.203: 105,33.5 R6.2
  Top 0.406: 105,33.5 106.5,35 110.69,35 S2.1
N$11
  Top 0.406: R9.2 105,24.5 106.5,23 111.47,23 S3.1
N$12
  Top 0.203: 105,16 R11.2
  Top 0.406: 105,16 106.5,17.5 111.68,17.5 S4.1
N$13
  Top 0.406: IC1.9 56.36,27.94 QZ1.1 48.26,30.48 C6.1
N$14
  Top 0.406: IC4.8 62.23,60.33 | 62.23,60.33 65.64,60.33 C10.+ | 62.23,60.33 62.23,64.38 D2.1
N$15
  Top 0.406: IC1.10 53.98,26.04 QZ1.2 C7.1
N$17
  Top 0.406: 25,64 25,60 IC3.8 28.8,59.69 C9.+
  Top 0.508: 25,64 D1.1
N$18
  Top 0.406: 37.5,73 37.5,69.23 37.33,69.06 R22.2 | 37.5,73 37.5,77 38,77.5 39,77.5 IC5.2 | 37.5,73 42.69,73 43.33,72.27 R24.2
N$19
  Top 0.406: IC3.6 24,57.15 22.86,58.29 22.86,69.22 R16.1
  Top 0.508: IC3.6 24.95,57.13 27.87,57.13 29,56 C9.-
  Top 0.813: D8.1 53.98,78.11 Q3.2 | Q1.3 23.5,81.92 23.5,72.39 R16.1
  Bottom 0.203: 9.5,85 D4.2
  Bottom 0.813: 9.5,85 22,85 23.5,83.5 Q1.3 23.5,90.17 27.3,93.98 39.37,93.98 41.91,91.44 41.91,88.27 44.45,85.72 48.9,85.72 Q3.2 | D8.1 62.1,78.11 60.37,76.37 60.37,73.49 61.37,72.5 70.77,72.5 78.66,80.39 X1.P1
N$20
  Top 0.406: IC5.6 44.67,76.25 45.25,76.25 46.5,75 46.5,69.98 47.42,69.06 R23.1 47.14,67.94 R25.1
N$21
  Top 0.203: 15.5,60.5 R12.2
  Top 0.406: 15.5,60.5 19.5,64.5 20.5,64.5 D1.2
N$22  (via drill 0.4)
  Top 0.406: IC3.7 v27.3,58.42
  Bottom 0.406: v27.3,58.42 23.5,62.23 23.5,72.39 R14.1 17.78,74.3 16.99,75.08 D3.1
N$24
  Top 0.406: R16.2 14,70.5 14,74 R14.2
  Bottom 0.203: 13.5,78 D3.2
  Bottom 0.406: 13.5,78 13.5,74.5 R14.2 | D3.2 13.49,79.53 Q1.1
N$25
  Top 0.813: R18.2 50.8,78.61 46.35,83.06 Q3.1
  Bottom 0.406: D7.2 52.07,70.48 50.8,71.75 R18.2
N$26  (via drill 0.4)
  Top 0.406: IC3.5 26.86,55.87 27.74,55 38.98,55 53.21,69.23 v55.88,69.23
  Bottom 0.406: v55.88,69.23 56.38,69.23 D7.1 58.42,71.28 R18.1
N$27
  Top 0.406: R13.2 52.22,64.29 52.7,64.77 D2.2
N$28
  Top 0.203: 75,70.5 D6.2
  Top 0.406: IC4.6 61.8,57.75 62.97,57.75 63.79,56.92 C10.- 69.62,56.92 70,57.3 70,70.5
  Top 0.813: 74.5,70.5 70,70.5 R17.1 | 74.5,70.5 D6.2 | 75,70.5 78.5,74 93.3,74 X1.P2 | Q4.2 34.92,83.94 36.25,85.26 53.97,85.26 58.59,80.64 64.14,80.64 65.41,81.92 Q2.3 67.82,80.77 71.12,80.77 74.5,77.39 74.5,70.5
  Bottom 0.203: 35,83 Q4.2
  Bottom 0.813: 35,83 35,82 31.11,78.11 D10.1
N$29
  Top 0.406: R15.1 67.31,74.3 66.67,73.66 66.67,67.94 67.94,66.67 67.94,59.05 67.31,58.42 64.14,58.42 63.5,59.05 IC4.7
  Bottom 0.406: R15.1 70.33,74.78 D5.1
N$32
  Top 0.406: R15.2 R17.2
  Bottom 0.406: R15.2 63.02,74.3 D5.2 64.92,80.01 60.96,80.01 60.33,80.64 Q2.1
N$33
  Top 0.813: R19.2 32.38,74.93 Q4.1
  Bottom 0.406: R19.2 33.02,70.48 32.38,69.85 D9.2
N$34
  Top 0.406: R19.1 25.4,70.48 31.16,64.73 47.24,64.73 54.64,72.14 58.04,72.14 60.13,70.04 60.13,56.7 60.33,56.52 IC4.5
  Bottom 0.406: D9.1 26.19,73.5 R19.1
R/W
  Bottom 0.406: IC2.2 81.86,20.32 83.82,18.36 HG1.5
REFERENCE_VALUE
  Top 0.508: IC1.12 50.51,20.95 43.38,13.82 R26.1 39.34,13.79 Z1.1
RESET  (via drill 0.35)
  Top 0.203: C13.1 | R4.1
  Top 0.406: J1.5 63.5,5.71 62.1,4.32 54.61,4.32 53.34,5.59 53.34,9.96 S1.3 | v53.98,36.83 53.98,45.88 IC1.1 55.21,50.67 C13.1 R4.1
  Bottom 0.406: S1.3 53.98,14.25 v53.98,36.83
S_LED  (via drill 0.35)
  Top 0.406: R8.1 88.11,33.15 92.05,29.21 99.44,29.21 102.23,26.42 102.23,24.38 104.9,21.72 114.81,21.72 116.71,23.62 116.71,33.4 113.67,36.45 104.78,36.45 100.33,40.89 100.33,45.09 98.42,46.99 83.19,46.99 81.92,48.26 81.92,50.16 80.64,51.44 v64.14,51.44
  Bottom 0.406: v64.14,51.44 63.36,50.66 63.36,48.79 62.2,47.64 56.27,47.64 55.71,47.07 55.71,44.15 56.05,43.81 IC1.3
SB_BACK  (via drill 0.4)
  Top 0.406: R11.1 107.57,15.77 v107.57,13.59
  Bottom 0.406: v107.57,13.59 107.57,19.43 97.79,29.21 93.98,29.21 88.94,34.25 68.02,34.25 67.41,34.87 58.31,34.87 IC1.6
SB_FOR-D  (via drill 0.4)
  Top 0.406: v58.46,37.5 55.84,37.5 55.24,38.1 55.24,40.64 55.88,41.27 IC1.4 | v109.69,29.98 109.69,30.8 R6.1
  Bottom 0.406: v109.69,29.98 98.05,29.98 90.53,37.5 v58.46,37.5
SB_STOP  (via drill 0.35)
  Top 0.406: R9.1 107.47,27.53 105.79,29.21 102.23,29.21 100.97,30.48 100.97,37.12 97.44,40.64 97.25,40.75 97.25,44.25 96,45.5 80.91,45.5 80.15,44.75 74.59,44.75 73.66,43.81 73.66,39.37 66.67,32.38 v62.87,32.38
  Bottom 0.406: v62.87,32.38 61.59,31.11 61.59,26.04 59.05,23.5 IC1.11
SCK
  Top 0.406: IC1.19 63.5,24.61 63.5,21.59 58.91,17 56.12,17 55.37,16.25 55.37,6.23 56.52,5.08 60.33,5.08 60.96,5.71 J1.3
  Bottom 0.406: IC2.11 70.95,30.48 66.5,26.04 IC1.19
SENS_1
  Bottom 0.203: 37.5,47.5 JP1.3
  Bottom 0.406: 37.5,47.5 45,40 61,40 64.5,43.5 IC1.26
SENS_2
  Bottom 0.203: 40,47.5 JP1.5
  Bottom 0.406: 40,47.5 45,42.5 61,42.5 64.5,46 IC1.27
SS
  Bottom 0.406: IC1.16 69.22,22.7 69.22,24.29 IC2.12

### Text on the board
tPlace: Designed and released by Daineko.A